# EAGLE schematic sample_and_hold (EAGLE 6.4)
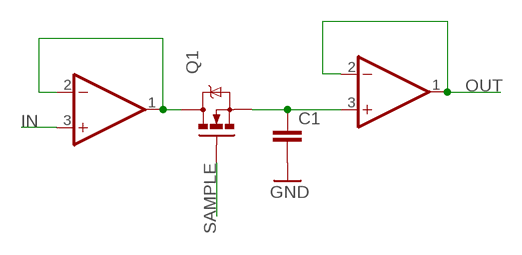
[diagram p0: schematic, sheet 1]

## Parts
C1  CAP0402-CAP  [0402-CAP]
IC1  MCP6022  [SOIC8_150MIL]
IC2  MCP6022  [SOIC8_150MIL]
Q1  MOSFET-NCHANNEL2N7000  [TO-92]

## Nets
GND: C1.2
IN: IC1.3(+IN)
N$2: IC1.1(OUT) IC1.2(-IN) Q1.3(D)
N$4: C1.1 IC2.3(+IN) Q1.1(S)
OUT: IC2.1(OUT) IC2.2(-IN)
SAMPLE: Q1.2(G)
Unconnected: IC1.4(-) IC1.5(+IN) IC1.6(-IN) IC1.7(OUT) IC1.8(+) IC2.4(-) IC2.5(+IN) IC2.6(-IN) IC2.7(OUT) IC2.8(+)

## Library data of the parts
C1 = SparkFun-Passives:CAP: Capacitor Standard 0603 ceramic capacitor, and 0.1" leaded capacitor.
IC1 IC2 = microbuilder:MCP6022: MCP6022 - Dual Rail-to-Rail 10MHz Op-Amp Digikey: SOIC8 - MCP6022-I/SN-ND
Q1 = SparkFun-DiscreteSemi:MOSFET-NCHANNEL: Common NMOSFET Parts MFG P/N Store ID Prod ID FDD8780 TRANS-09984 SI7820DN TRANS-11055 FDS6630A IC-08089 2N7002PW TRANS-11151 FQP30N06L COM-10213 TRANS-10060 BSS123LT1G TRANS-08345 BSS138 TRANS-00830 BS170 2N7000